# EAGLE design SLC_Free_PCB (EAGLE 6.2)
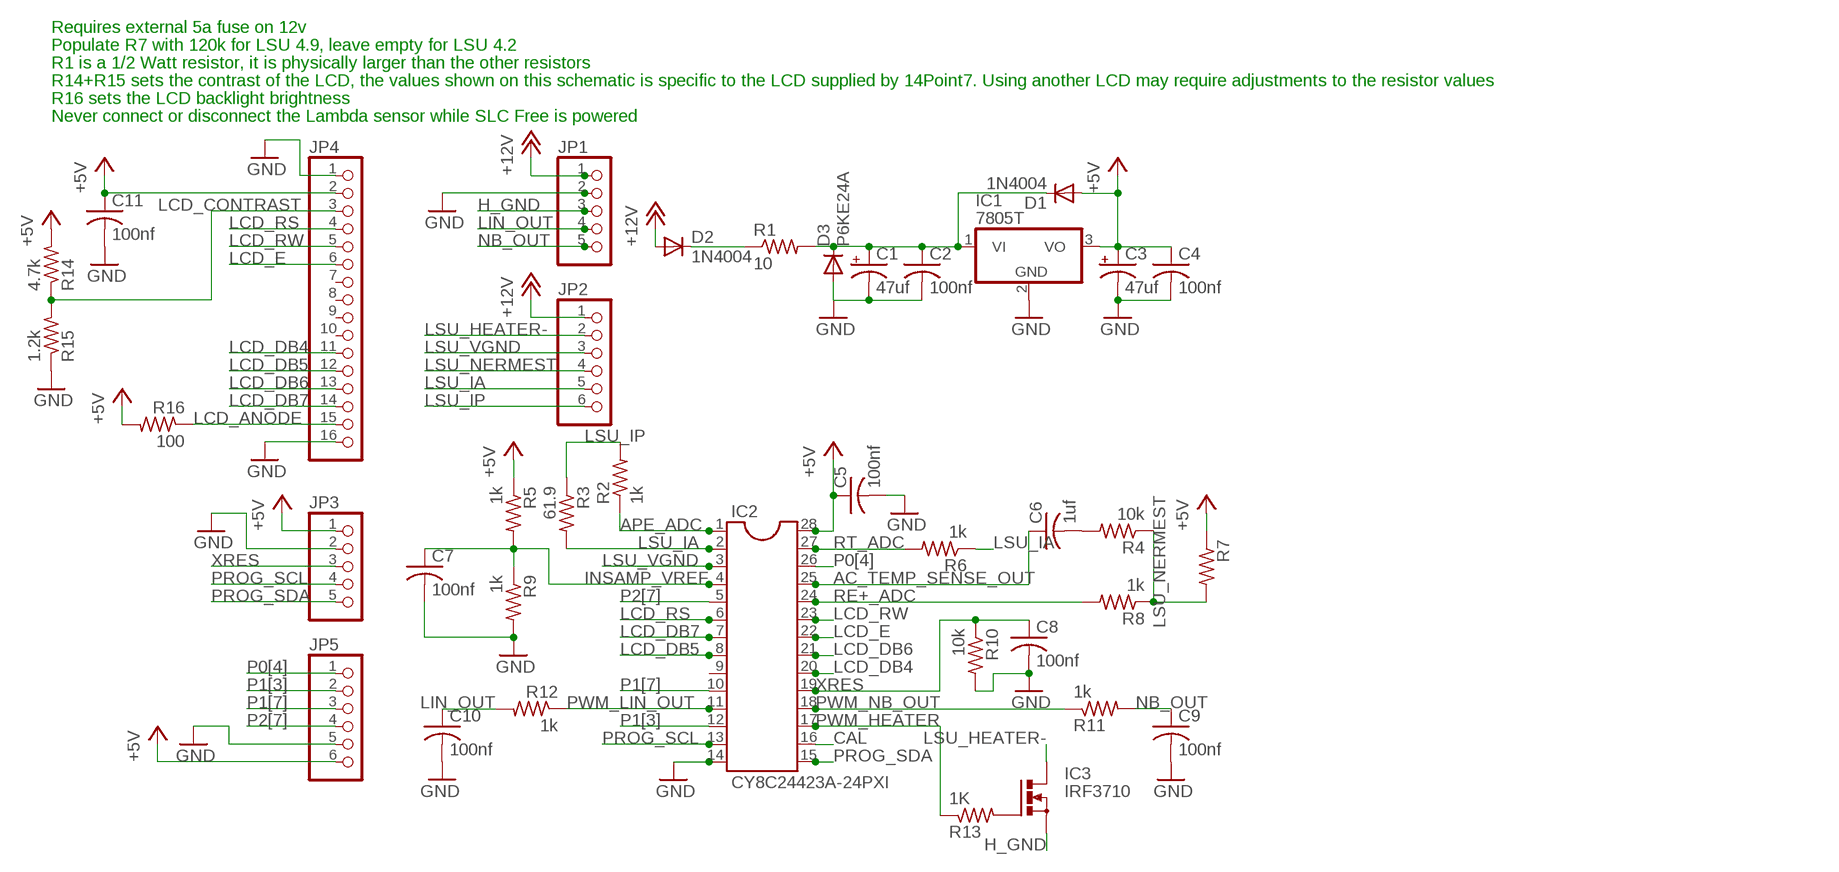
[diagram p0: schematic, sheet 1]

## Parts
C1  47uf  CPOL-USE2-5  [E2-5]
C2  100nf  C-US025-025X050  [C025-025X050]
C3  47uf  CPOL-USE2-5  [E2-5]
C4  100nf  C-US025-025X050  [C025-025X050]
C5  100nf  C-US025-025X050  [C025-025X050]
C6  1uf  C-US025-025X050  [C025-025X050]
C7  100nf  C-US025-025X050  [C025-025X050]
C8  100nf  C-US025-025X050  [C025-025X050]
C9  100nf  C-US025-025X050  [C025-025X050]
C10  100nf  C-US025-025X050  [C025-025X050]
C11  100nf  C-US025-025X050  [C025-025X050]
D1  1N4004  [DO41-10]
D2  1N4004  [DO41-10]
D3  P6KE24A  1N4004  [DO41-10]
IC1  7805T  [TO220H]
IC2  CY8C24423A-24PXI  DIL28-3  [DIL28-3]
IC3  IRF3710  BUZ11BH  [TO220BH]
JP1  PINHD-1X5  [1X05]
JP2  PINHD-1X6  [1X06]
JP3  PINHD-1X5  [1X05]
JP4  PINHD-1X16  [1X16]
JP5  PINHD-1X6  [1X06]
R1  10  R-US_0309/12  [0309/12]
R2  1k  R-US_0204/7  [0204/7]
R3  61.9  R-US_0204/7  [0204/7]
R4  10k  R-US_0204/7  [0204/7]
R5  1k  R-US_0204/7  [0204/7]
R6  1k  R-US_0204/7  [0204/7]
R7  R-US_0204/7  [0204/7]
R8  1k  R-US_0204/7  [0204/7]
R9  1k  R-US_0204/7  [0204/7]
R10  10k  R-US_0204/7  [0204/7]
R11  1k  R-US_0204/7  [0204/7]
R12  1k  R-US_0204/7  [0204/7]
R13  1K  R-US_0204/7  [0204/7]
R14  4.7k  R-US_0204/7  [0204/7]
R15  1.2k  R-US_0204/7  [0204/7]
R16  100  R-US_0204/7  [0204/7]

## Nets
+5V: C3.+ C4.1 C5.1 C11.1 D1.A IC1.3(VO) IC2.28 JP3.1 JP4.2 JP5.6 R5.1 R7.1 R14.2 R16.2
+12V: D2.A JP1.1 JP2.1
AC_TEMP_SENSE_OUT: C6.1 IC2.25
APE_ADC: IC2.1 R2.1
CAL: IC2.16
GND: C1.- C2.2 C3.- C4.2 C5.2 C7.2 C8.2 C9.2 C10.2 C11.2 D3.A IC1.2(GND) IC2.14 JP1.2 JP3.2 JP4.1 JP4.16 JP5.5 R9.2 R10.2 R15.1
H_GND: IC3.S JP1.3
INSAMP_VREF: C7.1 IC2.4 R5.2 R9.1
LCD_ANODE: JP4.15 R16.1
LCD_CONTRAST: JP4.3 R14.1 R15.2
LCD_DB4: IC2.20 JP4.11
LCD_DB5: IC2.8 JP4.12
LCD_DB6: IC2.21 JP4.13
LCD_DB7: IC2.7 JP4.14
LCD_E: IC2.22 JP4.6
LCD_RS: IC2.6 JP4.4
LCD_RW: IC2.23 JP4.5
LIN_OUT: C10.1 JP1.4 R12.2
LSU_HEATER-: IC3.D JP2.2
LSU_IA: IC2.2 JP2.5 R3.2 R6.1
LSU_IP: JP2.6 R2.2 R3.1
LSU_NERMEST: JP2.4 R4.1 R7.2 R8.1
LSU_VGND: IC2.3 JP2.3
N$1: C6.2 R4.2
N$2: C1.+ C2.1 D1.C D3.C IC1.1(VI) R1.2
N$4: IC3.G R13.2
N$5: D2.C R1.1
NB_OUT: C9.1 JP1.5 R11.2
P0[4]: IC2.26 JP5.1
P1[3]: IC2.12 JP5.2
P1[7]: IC2.10 JP5.3
P2[7]: IC2.5 JP5.4
PROG_SCL: IC2.13 JP3.4
PROG_SDA: IC2.15 JP3.5
PWM_HEATER: IC2.17 R13.1
PWM_LIN_OUT: IC2.11 R12.1
PWM_NB_OUT: IC2.18 R11.1
RE+_ADC: IC2.24 R8.2
RT_ADC: IC2.27 R6.2
XRES: C8.1 IC2.19 JP3.3 R10.1
Unconnected: IC2.9 JP4.7 JP4.8 JP4.9 JP4.10

## Notes on the sheet
- Requires external 5a fuse on 12v
- Populate R7 with 120k for LSU 4.9, leave empty for LSU 4.2
- R1 is a 1/2 Watt resistor, it is physically larger than the other resistors
- R14+R15 sets the contrast of the LCD, the values shown on this schematic is specific to the LCD supplied by 14Point7. Using another LCD may require adjustments to the resistor values
- R16 sets the LCD backlight brightness
- Never connect or disconnect the Lambda sensor while SLC Free is powered

## Library data of the parts
C1 C3 = rcl:CPOL-US: POLARIZED CAPACITOR, American symbol
C2 C4-C11 = rcl:C-US: CAPACITOR, American symbol
D1-D3 = diode:1N4004: DIODE general purpose rectifier, 1 A
IC1 = linear:78*: Positive VOLTAGE REGULATOR Source: http://cache.national.com/ds/LM/LM78L05.pdf http://www.fairchildsemi.com/ds/LM/LM7805.pdf
IC2 = ic-package:DIL28: Dual In Line
IC3 = transistor-power:BUZ11: N-CHANNEL MOS FET
JP1 JP3 = pinhead:PINHD-1X5: PIN HEADER
JP2 JP5 = pinhead:PINHD-1X6: PIN HEADER
JP4 = pinhead:PINHD-1X16: PIN HEADER
R1 = resistor:R-US_: RESISTOR, American symbol
R2-R16 = rcl:R-US_: RESISTOR, American symbol

## Board
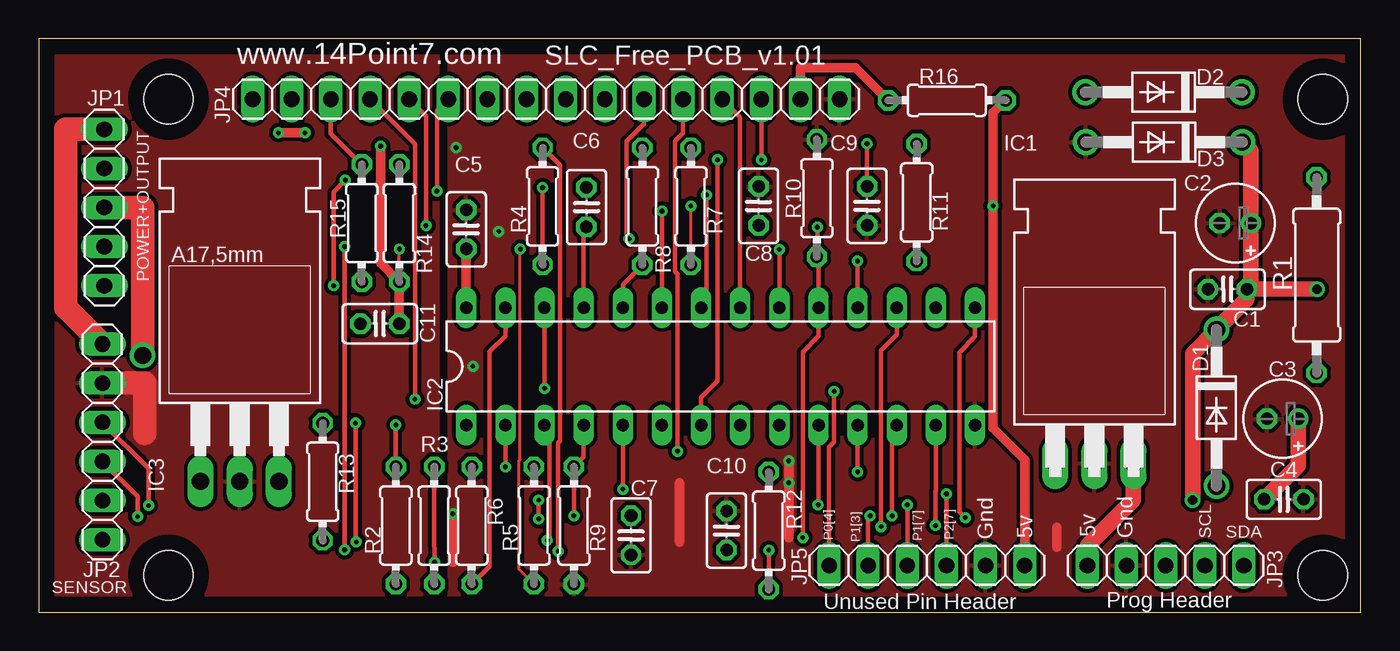
[diagram p1: board, top side]
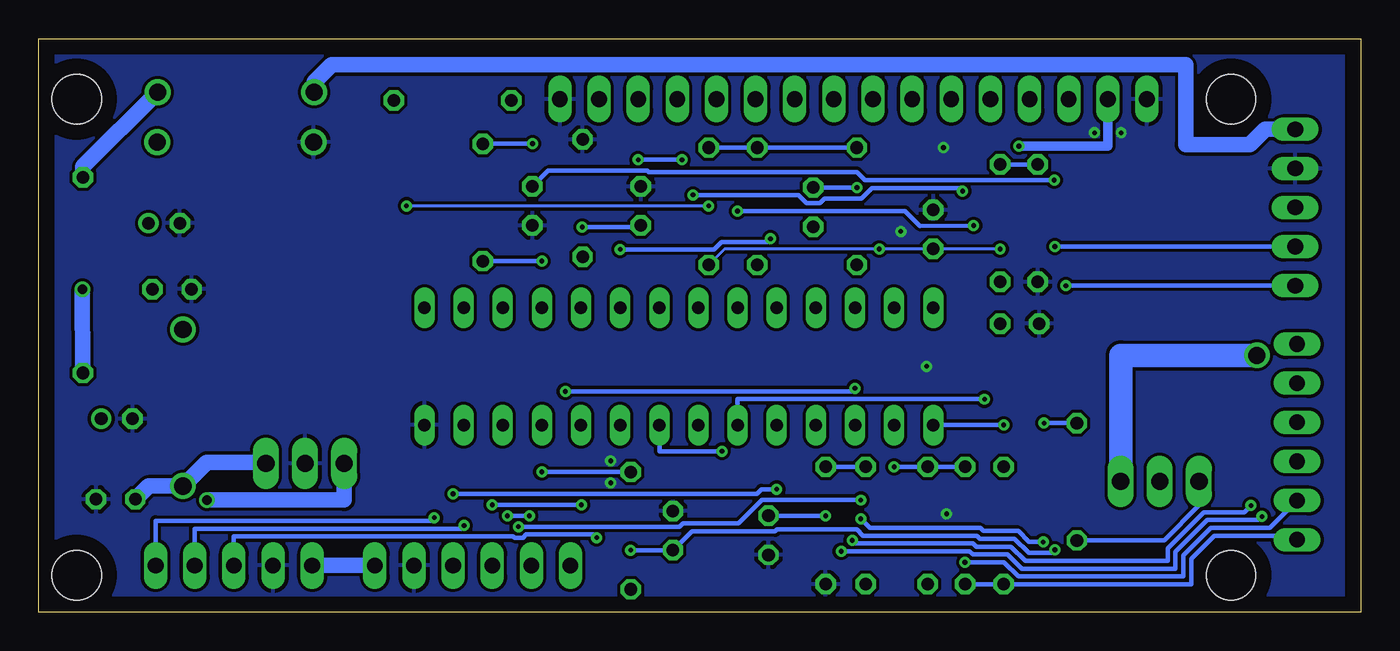
[diagram p2: board, bottom side, seen from below]

Size 85.83 x 37.26 mm. Coordinates in mm from the lower left corner, seen from the top.
Outline: 0,0 85.83,0 85.83,37.26 0,37.26 0,0
Copper layers (1*16): Top 0.035mm / dielectric 1.5mm / Bottom 0.035mm
Design rules: minimum track width 8mil, minimum drill 12mil, track to track 8mil, track to pad 8mil, pad to pad 8mil, via to via 8mil, smd to smd 8mil, copper to edge 40mil, drill to drill 8mil, minimum pad ring 10mil, minimum via ring 8mil, stop-mask expansion 2mil, vias tented up to drill 100mil, thermal gap 10mil
Holes 3.2 mm at 8.43,2.41 83.36,2.41 83.36,33.32 8.43,33.32

### Footprints (pad centres in the part's own frame; a part is rotated, then mirrored left to right if it is on the bottom)
E2-5 = drill 0.813 pad 1.27: + -1.016,0 | drill 0.813 pad 1.27 octagon: - 1.016,0
C025-025X050 = drill 0.813 octagon: 1 -1.27,0; 2 1.27,0
DO41-10 = drill 1.118: A 5.08,0; C -5.08,0
TO220H = drill 1.118 long: 1 -2.54,-10.16; 2 0,-10.16; 3 2.54,-10.16
DIL28-3 = drill 0.813 long: 1 -16.51,-3.81; 2 -13.97,-3.81; 3 -11.43,-3.81; 4 -8.89,-3.81; 5 -6.35,-3.81; 6 -3.81,-3.81; 7 -1.27,-3.81; 8 1.27,-3.81; 9 3.81,-3.81; 10 6.35,-3.81; 11 8.89,-3.81; 12 11.43,-3.81; 13 13.97,-3.81; 14 16.51,-3.81; 15 16.51,3.81; 16 13.97,3.81; 17 11.43,3.81; 18 8.89,3.81; 19 6.35,3.81; 20 3.81,3.81; 21 1.27,3.81; 22 -1.27,3.81; 23 -3.81,3.81; 24 -6.35,3.81; 25 -8.89,3.81; 26 -11.43,3.81; 27 -13.97,3.81; 28 -16.51,3.81
TO220BH = drill 1.118 long: D 0,-6.35; G -2.54,-6.35; S 2.54,-6.35
1X05 = drill 1.016 long: 1 -5.08,0; 2 -2.54,0; 3 0,0; 4 2.54,0; 5 5.08,0
1X06 = drill 1.016 long: 1 -6.35,0; 2 -3.81,0; 3 -1.27,0; 4 1.27,0; 5 3.81,0; 6 6.35,0
1X16 = drill 1.016 long: 1 -19.05,0; 2 -16.51,0; 3 -13.97,0; 4 -11.43,0; 5 -8.89,0; 6 -6.35,0; 7 -3.81,0; 8 -1.27,0; 9 1.27,0; 10 3.81,0; 11 6.35,0; 12 8.89,0; 13 11.43,0; 14 13.97,0; 15 16.51,0; 16 19.05,0
0309/12 = drill 0.813 octagon: 1 -6.35,0; 2 6.35,0
0204/7 = drill 0.813 octagon: 1 -3.81,0; 2 3.81,0

### Placement (x,y rotation side)
C1  77.67,25.27 180 top
C2  77.17,20.98 180 top
C3  80.75,12.57 180 top
C4  80.82,7.34 0 top
C5  27.76,24.87 90 top
C6  35.56,26.31 90 top
C7  38.46,5 270 top
C8  46.74,26.39 90 top
C9  53.77,26.39 270 top
C10  44.65,5.31 90 top
C11  22.15,18.75 180 top
D1  76.45,13.28 270 top
D2  73.03,33.78 180 top
D3  73.05,30.53 180 top
IC1  68.53,19.84 0 top
IC2  44.27,15.98 0 top
IC3  13.06,14.86 0 top
JP1  4.27,26.29 270 top
JP2  4.14,11.07 270 top
JP3  73.15,3.05 0 top
JP4  32.94,33.32 0 top
JP5  57.66,3.05 0 top
R1  82.96,21.89 270 top
R2  23.19,5.64 270 top
R3  25.68,5.64 90 top
R4  32.72,26.37 270 top
R5  32.16,5.64 90 top
R6  28.12,5.64 270 top
R7  42.34,26.37 90 top
R8  39.19,26.37 270 top
R9  34.75,5.64 270 top
R10  50.52,26.9 90 top
R11  57,26.62 90 top
R12  47.4,5.31 270 top
R13  18.44,8.48 270 top
R14  23.42,25.27 270 top
R15  20.98,25.27 90 top
R16  58.95,33.25 0 top

### Tracks (layer width: path | path; a pad name or v marks a point on that pad's centre or on a via)
+5V  (via drill 0.3)
  Top 0.203: R7.1 v42.34,26.39 | R14.2 v23.42,23.6 | R5.1 31.19,2.79 31.19,9.86 31.27,9.93 v31.27,23.6
  Top 0.61: IC2.28 C5.1 | C11.1 R14.2 22.2,22.68 v22.2,30.28 | R16.2 61.95,32.44 v61.95,26.39 61.95,11.96 64.01,9.91 JP5.6
  Top 1.016: IC1.3 71.07,7.31 68.07,4.32 JP3.1 | C3.+ 81.76,9.55 C4.1
  Bottom 0.203: R7.1 41.3,23.6 v31.27,23.6 C5.1 v23.42,23.6 | v42.34,26.39 v61.95,26.39
  Bottom 0.61: v22.2,30.28 16.43,30.28 JP4.2
  Bottom 1.016: IC1.3 71.15,9.75 74.91,9.75 D1.A 78.69,8.2 C4.1 | JP5.6 JP3.1
+12V
  Top 1.524: JP2.1 1.78,19.79 1.78,31.37 JP1.1
  Bottom 1.016: JP1.1 6.22,31.37 7.21,30.38 11.38,30.38 11.38,35.56 66.8,35.56 67.95,34.42 D2.A
AC_TEMP_SENSE_OUT
  Top 0.305: IC2.25 35.38,24.87 C6.1
APE_ADC  (via drill 0.3)
  Top 0.305: R2.1 v23.19,12.17
  Bottom 0.305: v23.19,12.17 IC2.1
GND  (via drill 0.3)
  Top 0.61: v17.3,31.14 v15.57,31.14 | 41.6,8.41 41.6,4.55 | 66.09,5.54 66.09,4.22 | 48.69,4.85 v48.69,8.41 v48.69,9.83 | 26.9,3.25 26.9,6.2
  other vias: 27.1,30.18 29.87,24.74 28.19,15.98 26.9,6.4
  pour Bottom: -1.09,38.07 89.15,38.33 88.9,-13.51 -1.35,-13.77
  pour Top (isolate 0.254): 26.67,38.61 90.42,38.61 90.42,-5.84 26.67,-5.84
H_GND  (via drill 1.1)
  Top 1.524: JP1.3 6.76,26.29 v6.76,16.69
  Bottom 1.524: IC3.S 15.6,16.69 v6.76,16.69
INSAMP_VREF  (via drill 0.3)
  Top 0.305: IC2.4 35.38,10.08 R9.1 v34.75,6.27
  Bottom 0.305: R5.2 R9.1 | C7.1 v34.75,6.27
LCD_ANODE
  Top 0.61: JP4.15 49.45,35.36 53.03,35.36 R16.1
LCD_CONTRAST
  Top 0.305: JP4.3 18.97,31.09 R15.2
  Bottom 0.305: R15.2 R14.1
LCD_DB4  (via drill 0.3)
  Top 0.305: JP4.11 39.29,31.72 38.18,30.61 38.18,24.41 v38.33,24.26 | v48.08,23.57 IC2.20
  Bottom 0.305: v48.08,23.57 41.99,23.57 41.5,24.05 38.53,24.05 v38.33,24.26
LCD_DB5  (via drill 0.3)
  Top 0.305: JP4.12 41.83,31.11 41.33,30.61 41.33,22.12 41.48,21.97 v41.48,10.46
  Bottom 0.305: v41.48,10.46 45.54,10.46 IC2.8
LCD_DB6
  Top 0.305: IC2.21 45.54,32.16 JP4.13
LCD_DB7  (via drill 0.3)
  Top 0.305: JP4.14 v46.91,29.39 | v44.07,29.39 44.07,15.01 43,13.95 IC2.7
  Bottom 0.305: v46.91,29.39 v44.07,29.39
LCD_E  (via drill 0.3)
  Top 0.305: IC2.22 43.36,20.14 v43.36,27.1 | v25.86,27.36 25.86,32.59 JP4.6
  Bottom 0.305: v43.36,27.1 36.52,27.1 35.99,26.57 35.13,26.57 34.82,26.87 32.41,26.87 31.73,27.56 26.06,27.56 v25.86,27.36
LCD_RS  (via drill 0.3)
  Top 0.305: v24.44,13.84 24.44,30.4 JP4.4
  Bottom 0.305: IC2.6 40.46,13.84 v24.44,13.84
LCD_RW  (via drill 0.3)
  Top 0.305: IC2.23 v40.46,26.06 | v25.15,25.12 25.15,32.23 JP4.5
  Bottom 0.305: v25.15,25.12 28.63,25.1 29.59,26.06 v40.46,26.06
LIN_OUT  (via drill 0.3)
  Top 0.305: v47.4,4.04 R12.2 | v19.86,23.75 v19.86,4.06
  Bottom 0.305: v47.4,4.04 C10.1 43.43,5.26 38.02,5.26 37.9,5.38 32.71,5.38 32.31,4.98 24.94,4.98 24.74,4.77 22.48,4.77 21.57,3.86 20.07,3.86 v19.86,4.06 | JP1.4 v19.86,23.75
LSU_HEATER-
  Top 1.524: 6.88,11.61 6.88,14.88 JP2.2
  pour Top (isolate 0.254): -2.79,40.39 25.91,40.39 25.91,-4.32 -2.79,-4.32
LSU_IA  (via drill 0.3)
  Top 0.305: IC2.2 v30.3,9.45 | v25.71,3.25 25.68,5.18 R3.2
  Bottom 0.305: R3.2 R6.1 v30.3,9.45 | JP2.5 5.92,5.49 9.75,5.49 11.53,3.71 11.53,2.34 22.25,2.34 23.17,3.25 v25.71,3.25
LSU_IP
  Bottom 0.305: R3.1 R2.2 11.02,1.83 11.02,3.48 9.53,4.98 4.39,4.98 JP2.6
LSU_NERMEST  (via drill 0.3)
  Top 0.305: v33.73,3.96 33.73,11 33.86,11.12 33.86,29.03 R4.1 | v6.43,6.22 6.43,7.52 JP2.4
  Bottom 0.305: v33.73,3.96 25.4,3.96 25.2,3.76 22.94,3.76 22.02,2.84 12.04,2.84 12.04,3.94 9.98,5.99 6.65,5.99 v6.43,6.22 | R7.2 R8.1 R4.1
LSU_VGND  (via drill 0.3)
  Top 0.305: v33.02,4.67 33.17,4.83 33.17,11.84 IC2.3 | v7.14,6.93 7.14,9.35 JP2.3
  Bottom 0.305: v33.02,4.67 32.82,4.47 25.17,4.47 24.97,4.27 22.71,4.27 21.79,3.35 12.55,3.35 12.55,4.17 10.21,6.5 7.57,6.5 v7.14,6.93
N$1  (via drill 0.3)
  Top 0.305: R4.2 v32.71,27.58
  Bottom 0.305: v32.71,27.58 C6.2
N$2  (via drill 0.6)
  Top 1.016: v74.91,7.29 74.91,16.81 D1.C 78.44,20.34 C2.1 | v82.98,20.98 C2.1 | C2.1 78.69,21.23 C1.+ 78.69,29.97 D3.C
  Bottom 1.016: IC1.1 65.99,7.29 v74.91,7.29 | R1.2 v82.98,20.98
N$4
  Bottom 0.305: 10.52,8.64 IC3.G 10.52,6.93 12.78,4.67 R13.2
N$5
  Bottom 1.016: D2.C 82.96,28.93 R1.1
NB_OUT  (via drill 0.3)
  Top 0.305: C9.1 v53.77,30.43 | v19.15,21.21 19.15,27.3 v19.91,28.07
  Bottom 0.305: v53.77,30.43 R11.2 | JP1.5 v19.15,21.21 | v19.91,28.07 32.18,28.07 32.71,28.6 46.23,28.6 46.3,28.68 52.76,28.68 C9.1
P0[4]  (via drill 0.3)
  Top 0.305: JP5.1 51.31,10.74 51.64,11.07 v51.64,14.35 | IC2.26 v32.84,14.55
  Bottom 0.305: v32.84,14.55 33.04,14.35 v51.64,14.35
P1[3]  (via drill 0.3)
  Top 0.305: JP5.2 53.85,6.15 v53.97,6.27 | v55.4,6.27 55.4,11.86 IC2.12
  Bottom 0.305: v53.97,6.27 v55.4,6.27
P1[7]  (via drill 0.3)
  Top 0.305: JP5.3 v56.39,6.98 | IC2.10 50.62,7.01 v50.6,6.98
  Bottom 0.305: v56.39,6.98 v50.6,6.98
P2[7]  (via drill 0.3)
  Top 0.305: JP5.4 v58.93,7.7 | v37.92,8 IC2.5
  Bottom 0.305: v58.93,7.7 39.22,7.7 38.91,8 v37.92,8
PROG_SCL  (via drill 0.3)
  Top 0.305: IC2.13 58.24,7.9 58.22,7.87 v58.22,5.64
  Bottom 0.305: JP3.4 75.69,5.44 58.42,5.44 v58.22,5.64
PROG_SDA  (via drill 0.3)
  Top 0.305: IC2.15 60.78,17.91 59.77,16.89 59.77,6.53 v60.15,6.15
  Bottom 0.305: JP3.5 78.23,5.94 60.35,5.94 v60.15,6.15
PWM_HEATER  (via drill 0.3)
  Top 0.305: v20.57,12.29 20.57,4.62 v20.62,4.57 | v54.69,5.56 54.69,17.02 55.7,18.03 IC2.17 | v32.46,6.07 v32.46,7.29
  Bottom 0.305: R13.1 v20.57,12.29 | v20.62,4.57 21.54,4.57 22.25,5.28 24.51,5.28 24.71,5.49 31.88,5.49 v32.46,6.07 | v32.46,7.29 38.89,7.29 40.41,5.77 44.02,5.77 44.22,5.56 v54.69,5.56
PWM_LIN_OUT  (via drill 0.3)
  Top 0.305: v53.16,9.12 IC2.11
  Bottom 0.305: v53.16,9.12 R12.1
PWM_NB_OUT  (via drill 0.3)
  Top 0.305: IC2.18 v53.16,22.81
  Bottom 0.305: v53.16,22.81 R11.1
RE+_ADC
  Top 0.305: IC2.24 37.92,21.29 R8.2
RT_ADC
  Top 0.305: R6.2 29.29,3 29.29,16.94 30.3,17.96 IC2.27
XRES  (via drill 0.3)
  Top 0.305: v50.55,25.02 R10.1 50.62,22.99 IC2.19 50.62,17.93 49.61,16.92 v49.61,4.85
  Bottom 0.305: JP3.3 73.15,4.93 55.02,4.93 54.94,4.85 54.38,4.85 54.18,5.05 49.81,5.05 v49.61,4.85 | v50.55,25.02 46.84,25.02 C8.1

### Text on the board
tNames: www.14Point7.com | SLC_Free_PCB_v1.01 | POWER+OUTPUT | SDA | P0[4] | P1[7] | P2[7] | Gnd | 5v | 5v | Gnd | SCL | P1[3] | SENSOR | Unused Pin Header | Prog Header